# EAGLE schematic ArduinoShield (EAGLE 7.6.0)
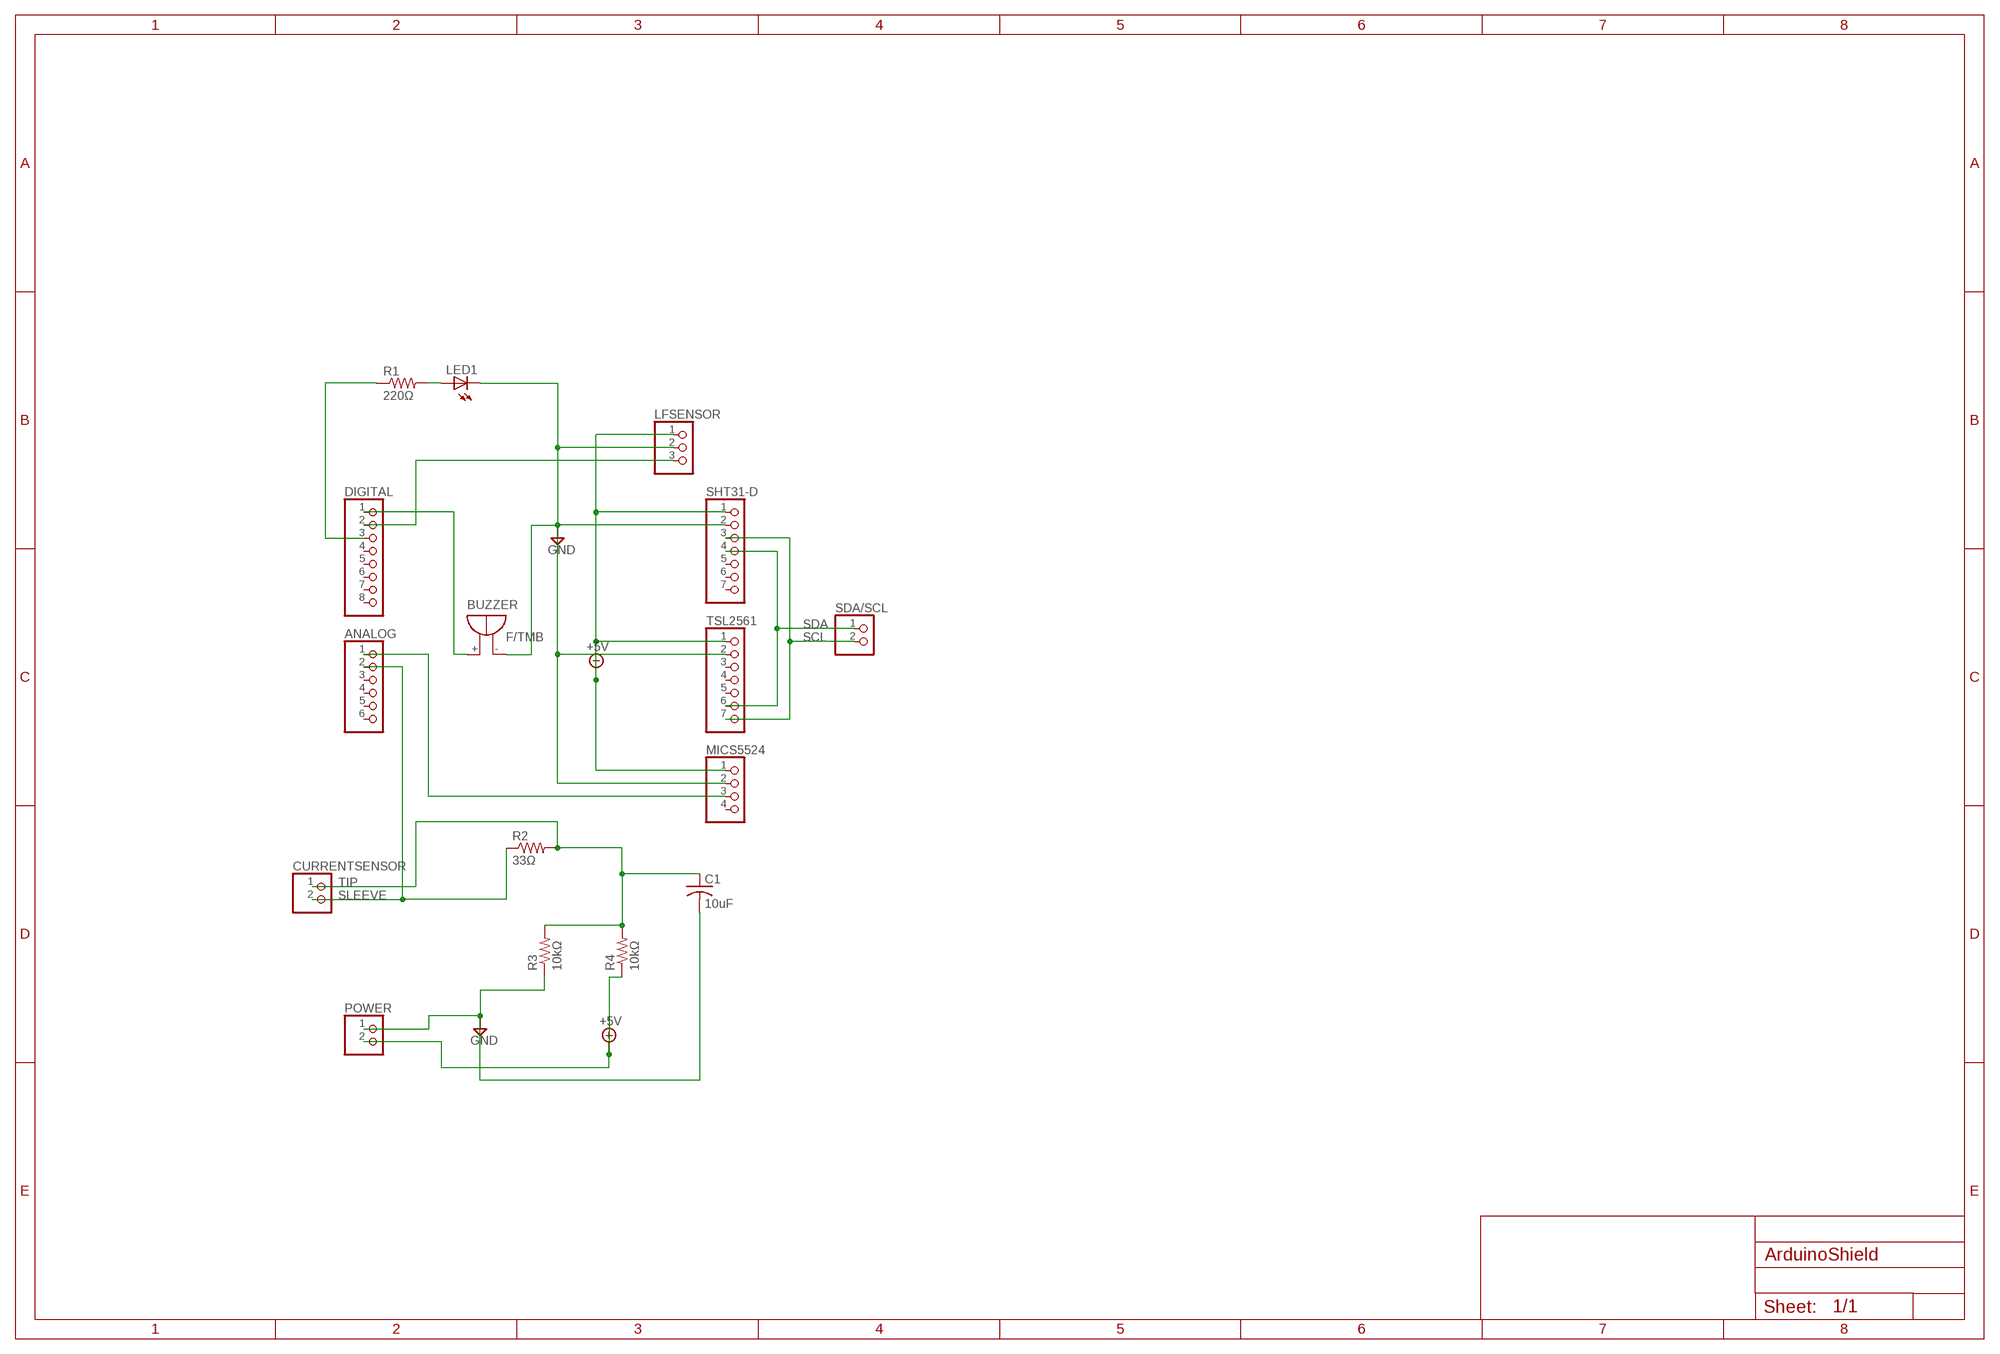
[diagram p0: schematic, sheet 1]

## Parts
ANALOG  PINHD-1X6  [1X06]
BUZZER  F/TMB  [F/TMB]
C1  10uF  C-US025-060X050  [C025-060X050]
CURRENTSENSOR  PINHD-1X2  [1X02]
DIGITAL  PINHD-1X8  [1X08]
LED1  LED5MM  [LED5MM]
LFSENSOR  PINHD-1X3  [1X03]
MICS5524  PINHD-1X4  [1X04]
POWER  PINHD-1X2  [1X02]
R1  220Ω  R-US_0309/12  [0309/12]
R2  33Ω  R-US_0309/12  [0309/12]
R3  10kΩ  R-US_0309/12  [0309/12]
R4  10kΩ  R-US_0309/12  [0309/12]
SDA/SCL  PINHD-1X2  [1X02]
SHT31-D  PINHD-1X7  [1X07]
TSL2561  PINHD-1X7  [1X07]

## Nets
+5V: LFSENSOR.1 MICS5524.1 POWER.2 R4.1 SHT31-D.1 TSL2561.1
GND: BUZZER.- C1.2 LED1.K(C) LFSENSOR.2 MICS5524.2 POWER.1 R3.1 SHT31-D.2 TSL2561.2
N$3: ANALOG.1 MICS5524.3
N$5: LED1.A R1.2
N$6: BUZZER.+ DIGITAL.1
N$8: DIGITAL.2 LFSENSOR.3
N$9: DIGITAL.3 R1.1
SCL: SDA/SCL.2 SHT31-D.3 TSL2561.7
SDA: SDA/SCL.1 SHT31-D.4 TSL2561.6
SLEEVE: ANALOG.2 CURRENTSENSOR.2 R2.1
TIP: C1.1 CURRENTSENSOR.1 R2.2 R3.2 R4.2
Unconnected: ANALOG.3 ANALOG.4 ANALOG.5 ANALOG.6 DIGITAL.4 DIGITAL.5 DIGITAL.6 DIGITAL.7 DIGITAL.8 MICS5524.4 SHT31-D.5 SHT31-D.6 SHT31-D.7 TSL2561.3 TSL2561.4 TSL2561.5

## Library data of the parts
ANALOG = pinhead:PINHD-1X6: PIN HEADER
BUZZER = buzzer:F/TMB: BUZZER Source: Buerklin; OC_FARNELL: unknown; OC_NEWARK: unknown
C1 = adafruit:C-US: CAPACITOR, American symbol
CURRENTSENSOR POWER SDA/SCL = pinhead:PINHD-1X2: PIN HEADER
DIGITAL = pinhead:PINHD-1X8: PIN HEADER
LED1 = adafruit:LED: LED OSRAM: - CHIPLED LG R971, LG N971, LY N971, LG Q971, LY Q971, LO R971, LY R971 LH N974, LH R974 LS Q976, LO Q976, LY Q976 LO Q996 - Hyper CHIPLED LW Q18S LB Q993, LB Q99A, LB R99A - SideLED LS A670, LO A670, LY A670, LG A670, LP A670 LB A673, LV A673, LT A673, LW A673 LH A674 LY A675 LS A676, LA A676, LO A676, LY A676, LW A676 LS A679, LY A679, LG A679 - Hyper Micro SIDELED® LS Y876, LA Y876, LO Y876, LY Y876 LT Y87S - SmartLED LW L88C, LW L88S LB L89C, LB L89S, LG L890 LS L89K, LO L89K, LY L89K LS L896, LA L896, LO L896, LY L896 - TOPLED LS T670, LO T670, LY T670, LG T670, LP T670 LSG T670, LSP T670, LSY T670, LOP T670, LYG T670 LG T671, LOG T671, LSG T671 LB T673, LV T673, LT T673, LW T673 LH T674 LS T676, LA T676, LO T676, LY T676, LB T676, LH T676, LSB T676, LW T676 LB T67C, LV T67C, LT T67C, LS T67K, LO T67K, LY T67K, LW E67C LS E67B, LA E67B, LO E67B, LY E67B, LB E67C, LV E67C, LT E67C LW T67C LS T679, LY T679, LG T679 LS T770, LO T770, LY T770, LG T770, LP T770 LB T773, LV T773, LT T773, LW T773 LH T774 LS E675, LA E675, LY E675, LS T675 LS T776, LA T776, LO T776, LY T776, LB T776 LHGB T686 LT T68C, LB T68C - Hyper Mini TOPLED® LB M676 - Mini TOPLED Santana® LG M470 LS M47K, LO M47K, LY M47K Source: http://www.osram.convergy.de/
LFSENSOR = pinhead:PINHD-1X3: PIN HEADER
MICS5524 = pinhead:PINHD-1X4: PIN HEADER
R1-R4 = adafruit:R-US_: RESISTOR, American symbol
SHT31-D TSL2561 = pinhead:PINHD-1X7: PIN HEADER